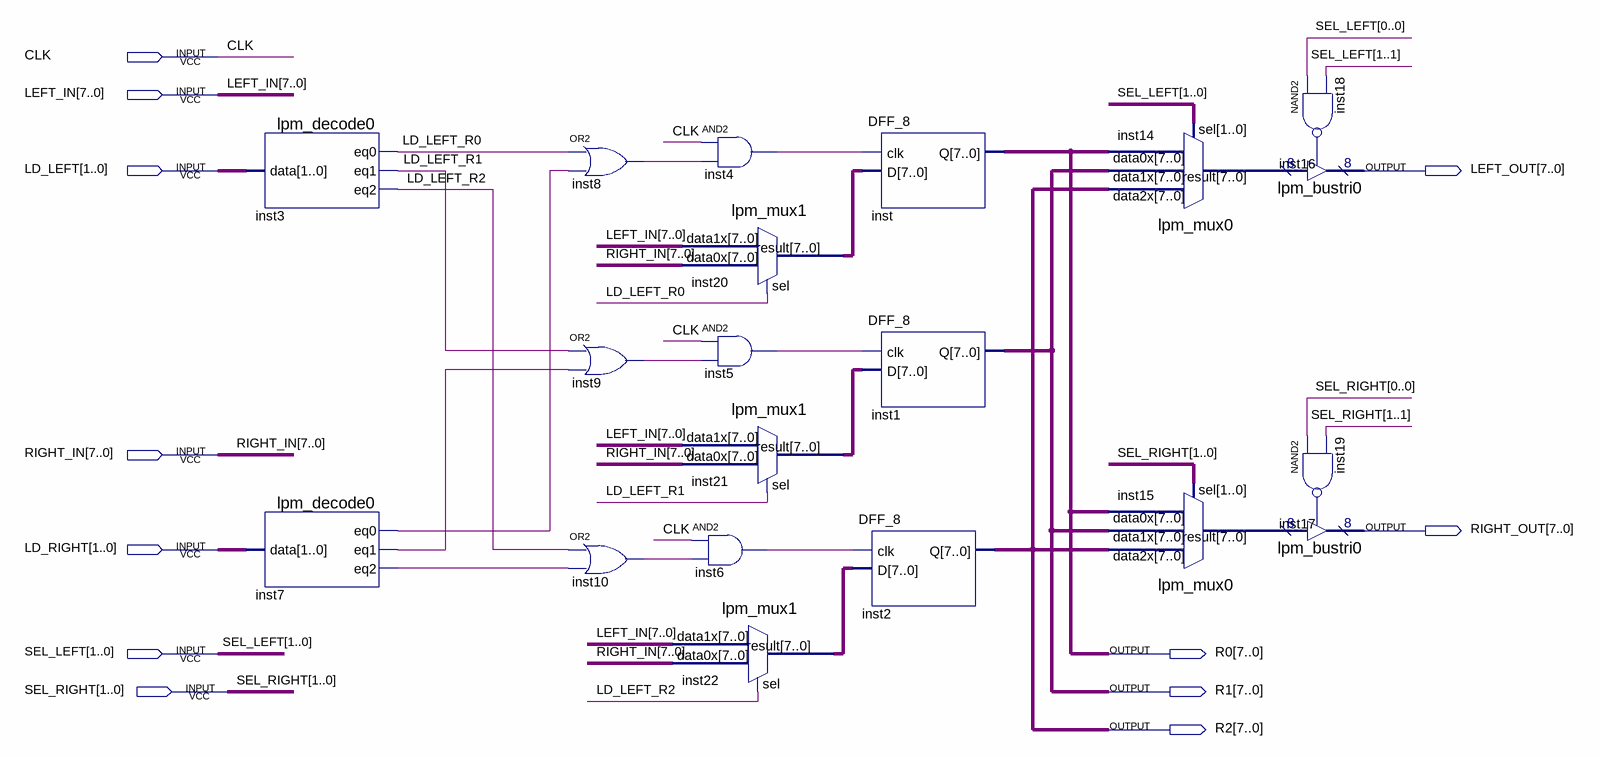
[diagram p0: schematic sheet]
// Quartus schematic REG2.bdf as structural Verilog: 20 symbols, 12 pins
module REG2 (
  input  CLK,
  input  [7:0] LEFT_IN,
  input  [1:0] LD_LEFT,
  input  [7:0] RIGHT_IN,
  input  [1:0] LD_RIGHT,
  input  [1:0] SEL_LEFT,
  input  [1:0] SEL_RIGHT,
  output [7:0] LEFT_OUT,
  output [7:0] RIGHT_OUT,
  output [7:0] R0,
  output [7:0] R1,
  output [7:0] R2
);

  wire inst4_out, inst5_out, inst6_out, inst7_eq0, inst7_eq1, inst7_eq2, inst8_out, inst9_out, inst10_out,
       inst18_out, inst19_out, LD_LEFT_R0, LD_LEFT_R1, LD_LEFT_R2;
  wire [7:0] inst14_result, inst15_result, inst20_result, inst21_result, inst22_result;

  lpm_decode0 inst3 (.data(LD_LEFT), .eq0(LD_LEFT_R0), .eq1(LD_LEFT_R1), .eq2(LD_LEFT_R2));
  lpm_decode0 inst7 (.data(LD_RIGHT), .eq0(inst7_eq0), .eq1(inst7_eq1), .eq2(inst7_eq2));
  or inst8 (inst8_out, LD_LEFT_R0, inst7_eq0);
  or inst9 (inst9_out, LD_LEFT_R1, inst7_eq1);
  or inst10 (inst10_out, LD_LEFT_R2, inst7_eq2);
  lpm_mux1 inst20 (.data1x(LEFT_IN), .data0x(RIGHT_IN), .sel(LD_LEFT_R0), .result(inst20_result));
  lpm_mux1 inst21 (.data1x(LEFT_IN), .data0x(RIGHT_IN), .sel(LD_LEFT_R1), .result(inst21_result));
  and inst6 (inst6_out, CLK, inst10_out);
  lpm_mux1 inst22 (.data1x(LEFT_IN), .data0x(RIGHT_IN), .sel(LD_LEFT_R2), .result(inst22_result));
  and inst4 (inst4_out, CLK, inst8_out);
  and inst5 (inst5_out, CLK, inst9_out);
  DFF_8 inst (.clk(inst4_out), .D(inst20_result), .Q(R0));
  DFF_8 inst1 (.clk(inst5_out), .D(inst21_result), .Q(R1));
  DFF_8 inst2 (.clk(inst6_out), .D(inst22_result), .Q(R2));
  lpm_mux0 inst14 (.data2x(R2), .data1x(R1), .data0x(R0), .sel(SEL_LEFT), .result(inst14_result));
  lpm_mux0 inst15 (.data2x(R2), .data1x(R1), .data0x(R0), .sel(SEL_RIGHT), .result(inst15_result));
  nand inst18 (inst18_out, SEL_LEFT[0], SEL_LEFT[1]);
  lpm_bustri0 inst16 (.enabledt(inst18_out), .data(inst14_result), .tridata(LEFT_OUT));
  nand inst19 (inst19_out, SEL_RIGHT[0], SEL_RIGHT[1]);
  lpm_bustri0 inst17 (.enabledt(inst19_out), .data(inst15_result), .tridata(RIGHT_OUT));
endmodule
